# Altium schematic sheet Sheet_1_2023-09-30.schdoc
size 289 x 202 mm
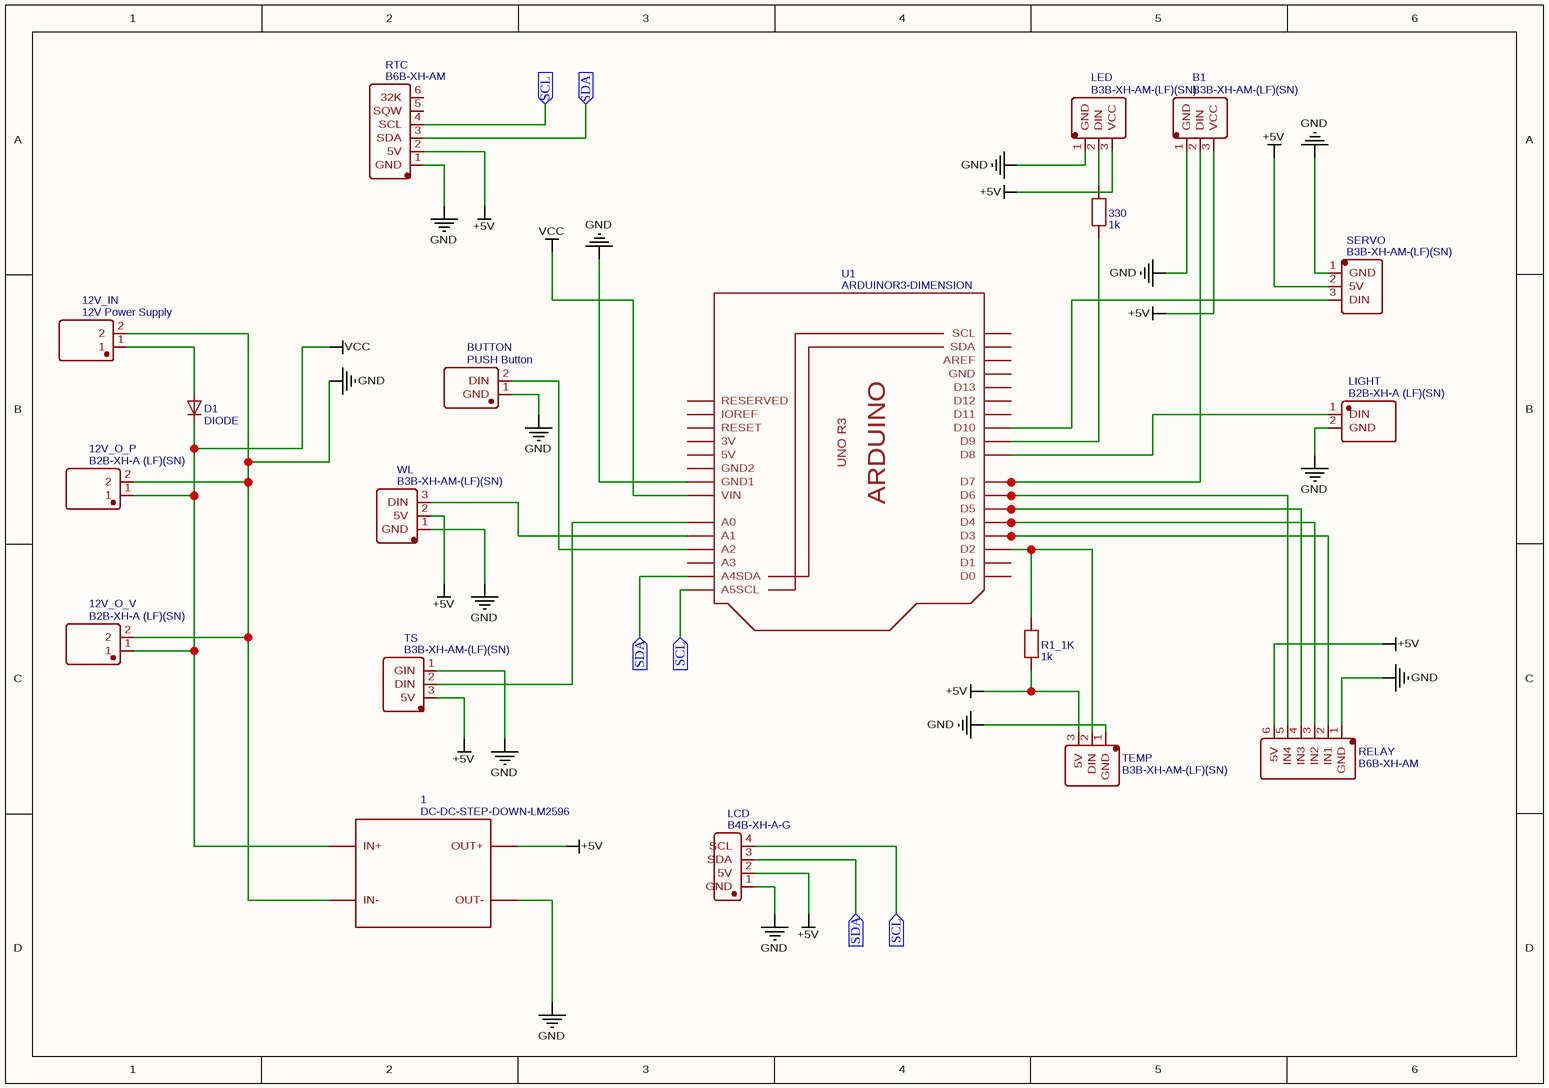
[diagram p0: Sheet_1_2023-09-30.schdoc]

## Parts
1  DC-DC-STEP-DOWN-LM2596  [DC-DC-STEP-DOWN-LM2596]
12V_IN  12V Power Supply  [CONN-TH_B2B-XH-A-LF-SN]
12V_O_P  B2B-XH-A (LF)(SN)  [CONN-TH_B2B-XH-A-LF-SN]
12V_O_V  B2B-XH-A (LF)(SN)  [CONN-TH_B2B-XH-A-LF-SN]
330  1k  [R_AXIAL-0.3]
B1  B3B-XH-AM-(LF)(SN)  [CONN-TH_3P-P2.50_B3B-XH-AM-LF-SN]
BUTTON  PUSH Button  [CONN-TH_B2B-XH-A-LF-SN]
D1  DIODE  [DIODE-1N4001]
LCD  B4B-XH-A-G  [CONN-TH_B4B-XH-A-G]
LED  B3B-XH-AM-(LF)(SN)  [CONN-TH_3P-P2.50_B3B-XH-AM-LF-SN]
LIGHT  B2B-XH-A (LF)(SN)  [CONN-TH_B2B-XH-A-LF-SN]
R1_1K  1k  [R_AXIAL-0.3]
RELAY  B6B-XH-AM  [CONN-TH_6P-P2.50_B6B-XH-AM-LF-SN]
RTC  B6B-XH-AM  [CONN-TH_6P-P2.50_B6B-XH-AM-LF-SN]
SERVO  B3B-XH-AM-(LF)(SN)  [CONN-TH_3P-P2.50_B3B-XH-AM-LF-SN]
TEMP  B3B-XH-AM-(LF)(SN)  [CONN-TH_3P-P2.50_B3B-XH-AM-LF-SN]
TS  B3B-XH-AM-(LF)(SN)  [CONN-TH_3P-P2.50_B3B-XH-AM-LF-SN]
U1  ARDUINOR3-DIMENSION  [ARDUINOR3]
WL  B3B-XH-AM-(LF)(SN)  [CONN-TH_3P-P2.50_B3B-XH-AM-LF-SN]

## Ports
SCL (in), SDA (in)

## Nets
+5V: 1.OUT+ B1.3(VCC) LCD.2(5V) LED.3(VCC) R1_1K.1 RELAY.6(5V) RTC.2(5V) SERVO.2(5V) TEMP.3(5V) TS.3(5V) WL.2(5V)
GND: 1.IN- 1.OUT- 12V_IN.2 12V_O_P.2 12V_O_V.2 B1.1(GND) BUTTON.1(GND) LCD.1(GND) LED.1(GND) LIGHT.2(GND) RELAY.1(GND) RTC.1(GND) SERVO.1(GND) TEMP.1(GND) TS.1(GIN) U1.GND1 WL.1(GND)
VCC: 1.IN+ 12V_O_P.1 12V_O_V.1 D1.C U1.VIN
SCL: LCD.4(SCL) RTC.4(SCL) U1.A5(A5SCL) ; port SCL
SDA: LCD.3(SDA) RTC.3(SDA) U1.A4(A4SDA) ; port SDA
Net12V_IN_1: 12V_IN.1 D1.A
Net330_1: 330.1 U1.D9
Net330_2: 330.2 LED.2(DIN)
NetB1_2: B1.2(DIN) U1.D7
NetBUTTON_2: BUTTON.2(DIN) U1.A2
NetLIGHT_1: LIGHT.1(DIN) U1.D8
NetR1_1K_2: R1_1K.2 TEMP.2(DIN) U1.D2
NetRELAY_2: RELAY.2(IN1) U1.D3
NetRELAY_3: RELAY.3(IN2) U1.D4
NetRELAY_4: RELAY.4(IN3) U1.D5
NetRELAY_5: RELAY.5(IN4) U1.D6
NetSERVO_3: SERVO.3(DIN) U1.D10
NetTS_2: TS.2(DIN) U1.A0
NetU1_A1: U1.A1 WL.3(DIN)

Not connected (* = marked no-connect by the designer): RTC 5(SQW) 6(32K); U1 3V 5V A3 AREF D0 D1 D11 D12 D13 GND GND2 IOREF RESERVED RESET SCL SDA

## Notes on the sheet
- (in symbol ARDUINOR3-DIMENSION) UNO R3; ARDUINO

## Library data of the parts
1 = DC-DC-STEP-DOWN-LM2596: Contributor: irukaict; Package Display: No; spicePre: ?; spiceSymbolName: DC-DC-STEP-DOWN-LM2596
12V_IN = 12V Power Supply: BOM_Manufacturer: JST; BOM_Manufacturer Part: B2B-XH-A(LF)(SN); Contributor: LCSC; BOM_Supplier: LCSC; BOM_Supplier Part: C158012; BOM_JLCPCB Part Class: Extended Part; spicePre: C; spiceSymbolName: B2B-XH-A (LF)(SN)
12V_O_P 12V_O_V LIGHT = B2B-XH-A (LF)(SN): BOM_Manufacturer: JST; Contributor: LCSC; BOM_Supplier: LCSC; BOM_Supplier Part: C158012; BOM_Manufacturer Part: B2B-XH-A(LF)(SN); BOM_JLCPCB Part Class: Extended Part; spicePre: C; spiceSymbolName: B2B-XH-A (LF)(SN)
330 R1_1K = 1k: nameAlias: Value(Ω); Contributor: LCEDA_Lib; spicePre: R; spiceSymbolName: R_0603_EU
B1 LED SERVO TEMP TS WL = B3B-XH-AM-(LF)(SN): BOM_Manufacturer: JST; BOM_Manufacturer Part: B3B-XH-AM(LF)(SN); Contributor: LCSC; BOM_Supplier: LCSC; BOM_Supplier Part: C161870; BOM_JLCPCB Part Class: Extended Part; spicePre: U; spiceSymbolName: B3B-XH-AM-(LF)(SN)
BUTTON = PUSH Button: BOM_Manufacturer: JST; BOM_Manufacturer Part: B2B-XH-A(LF)(SN); Contributor: LCSC; BOM_Supplier: LCSC; BOM_Supplier Part: C158012; BOM_JLCPCB Part Class: Extended Part; spicePre: C; spiceSymbolName: B2B-XH-A (LF)(SN)
D1 = DIODE: Contributor: Mskaa; spicePre: D; spiceSymbolName: DIODE
LCD = B4B-XH-A-G: BOM_Manufacturer: JST; Contributor: LCSC; BOM_Supplier: LCSC; BOM_Supplier Part: C594232; BOM_Manufacturer Part: B4B-XH-A-G; BOM_JLCPCB Part Class: Extended Part; spicePre: U; spiceSymbolName: B4B-XH-A-G
RELAY RTC = B6B-XH-AM: BOM_Manufacturer: JST; Contributor: lcsc; BOM_Supplier: LCSC; BOM_Supplier Part: C5306541; BOM_Manufacturer Part: B6B-XH-AM; link: https://atta.szlcsc.com/upload/public/pdf/source/20210915/55C2150F8D01CCBD7F61D7DC07E45ED6.pdf; spicePre: C; spiceSymbolName: B6B-XH-AM
U1 = ARDUINOR3-DIMENSION: description: This is a new object for the new Arduino R3 - with extra pins that you may want to use (such as IOref, and duplicated A4A5; Contributor: Adafruit; spicePre: U; spiceSymbolName: ARDUINOR3-DIMENSION